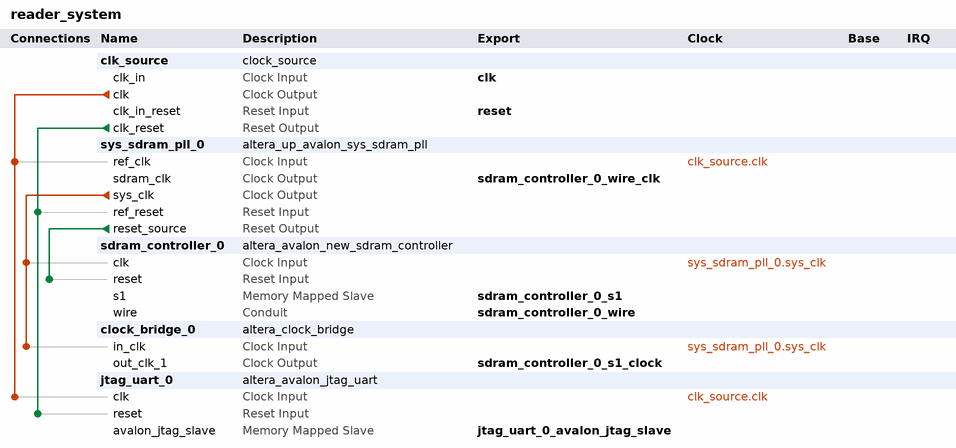
[diagram p0: system contents]
# Platform Designer (Qsys) system reader_system, Cyclone V 5CSEMA5F31C6
# Parameters at their usual value, and those the tool derives, are not listed.
package require -exact qsys 16.0
create_system reader_system
set_project_property DEVICE_FAMILY {Cyclone V}
set_project_property DEVICE 5CSEMA5F31C6

add_instance clk_source clock_source 16.0
set_instance_parameter_value clk_source clockFrequency 50000000

add_instance sys_sdram_pll_0 altera_up_avalon_sys_sdram_pll 16.1
set_instance_parameter_value sys_sdram_pll_0 CV_boards DE1-SoC
set_instance_parameter_value sys_sdram_pll_0 gui_outclk 133.33
set_instance_parameter_value sys_sdram_pll_0 gui_refclk 50.0

add_instance sdram_controller_0 altera_avalon_new_sdram_controller 16.0
set_instance_parameter_value sdram_controller_0 TAC 5.4
set_instance_parameter_value sdram_controller_0 TRCD 15.0
set_instance_parameter_value sdram_controller_0 TRP 15.0
set_instance_parameter_value sdram_controller_0 casLatency 2
set_instance_parameter_value sdram_controller_0 columnWidth 10
set_instance_parameter_value sdram_controller_0 dataWidth 16
set_instance_parameter_value sdram_controller_0 generateSimulationModel true
set_instance_parameter_value sdram_controller_0 model single_Micron_MT48LC4M32B2_7_chip
set_instance_parameter_value sdram_controller_0 numberOfBanks 4
set_instance_parameter_value sdram_controller_0 numberOfChipSelects 1
set_instance_parameter_value sdram_controller_0 powerUpDelay 100.0
set_instance_parameter_value sdram_controller_0 refreshPeriod 7.8125
set_instance_parameter_value sdram_controller_0 rowWidth 13

add_instance clock_bridge_0 altera_clock_bridge 16.0
set_instance_parameter_value clock_bridge_0 DERIVED_CLOCK_RATE 133333333
set_instance_parameter_value clock_bridge_0 EXPLICIT_CLOCK_RATE 0
set_instance_parameter_value clock_bridge_0 NUM_CLOCK_OUTPUTS 2

add_instance jtag_uart_0 altera_avalon_jtag_uart 16.0
set_instance_parameter_value jtag_uart_0 simInteractiveOptions NO_INTERACTIVE_WINDOWS

# connections
add_connection clk_source.clk jtag_uart_0.clk clock
add_connection clk_source.clk sys_sdram_pll_0.ref_clk clock
add_connection sys_sdram_pll_0.sys_clk clock_bridge_0.in_clk clock
add_connection sys_sdram_pll_0.sys_clk sdram_controller_0.clk clock
add_connection clk_source.clk_reset jtag_uart_0.reset reset
add_connection clk_source.clk_reset sys_sdram_pll_0.ref_reset reset
add_connection sys_sdram_pll_0.reset_source sdram_controller_0.reset reset

# exported interfaces
add_interface clk clock sink
set_interface_property clk EXPORT_OF clk_source.clk_in
add_interface jtag_uart_0_avalon_jtag_slave avalon slave
set_interface_property jtag_uart_0_avalon_jtag_slave EXPORT_OF jtag_uart_0.avalon_jtag_slave
add_interface reset reset sink
set_interface_property reset EXPORT_OF clk_source.clk_in_reset
add_interface sdram_controller_0_s1 avalon slave
set_interface_property sdram_controller_0_s1 EXPORT_OF sdram_controller_0.s1
add_interface sdram_controller_0_s1_clock clock source
set_interface_property sdram_controller_0_s1_clock EXPORT_OF clock_bridge_0.out_clk_1
add_interface sdram_controller_0_wire conduit end
set_interface_property sdram_controller_0_wire EXPORT_OF sdram_controller_0.wire
add_interface sdram_controller_0_wire_clk clock source
set_interface_property sdram_controller_0_wire_clk EXPORT_OF sys_sdram_pll_0.sdram_clk

set_interconnect_requirement {$system} qsys_mm.clockCrossingAdapter HANDSHAKE
set_interconnect_requirement {$system} qsys_mm.enableEccProtection FALSE
set_interconnect_requirement {$system} qsys_mm.insertDefaultSlave FALSE
set_interconnect_requirement {$system} qsys_mm.maxAdditionalLatency 1

save_system reader_system.qsys
